# Altium schematic sheet MultimediaEthernet_BUTTON.SchDoc
size Letter
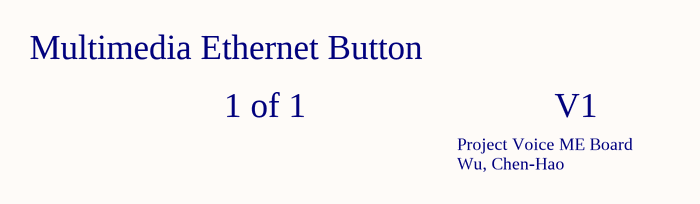
[diagram p0: MultimediaEthernet_BUTTON.SchDoc]

## Notes on the sheet
- Multimedia Ethernet Button
- 1 of 1
- Project Voice ME Board
- V1
- Wu, Chen-Hao